# EAGLE design open-lux-E (EAGLE 6.5.0)
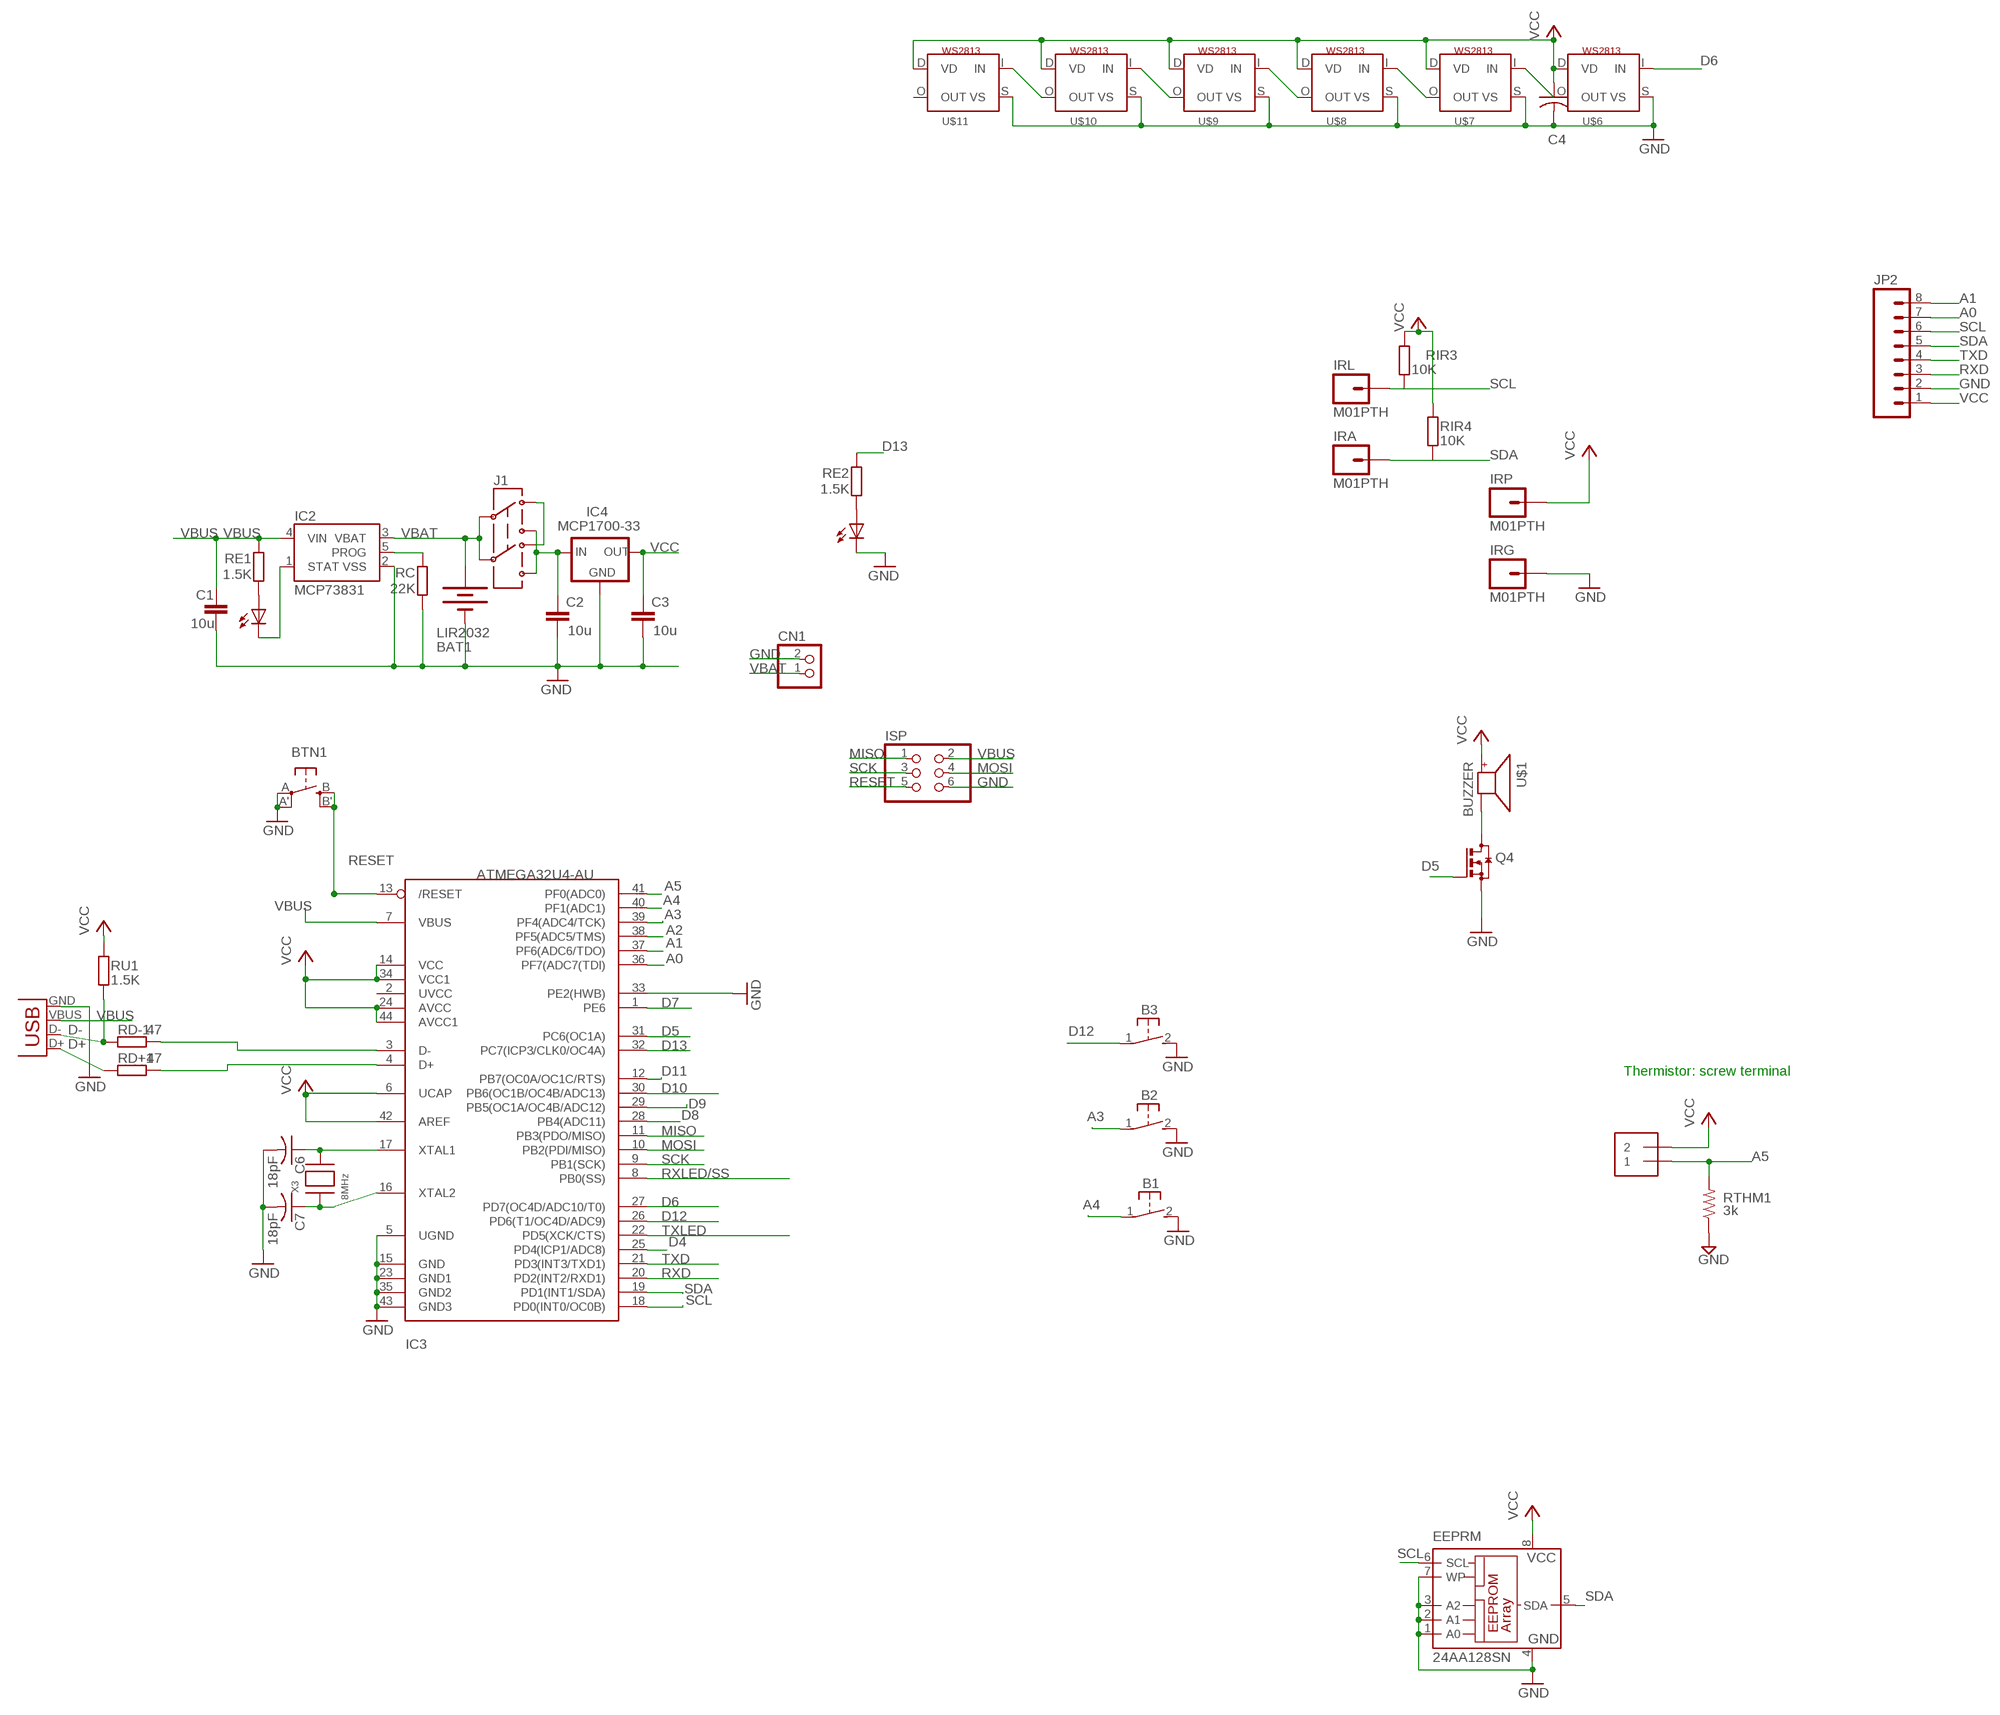
[diagram p0: schematic, sheet 1, part 1 of 2]
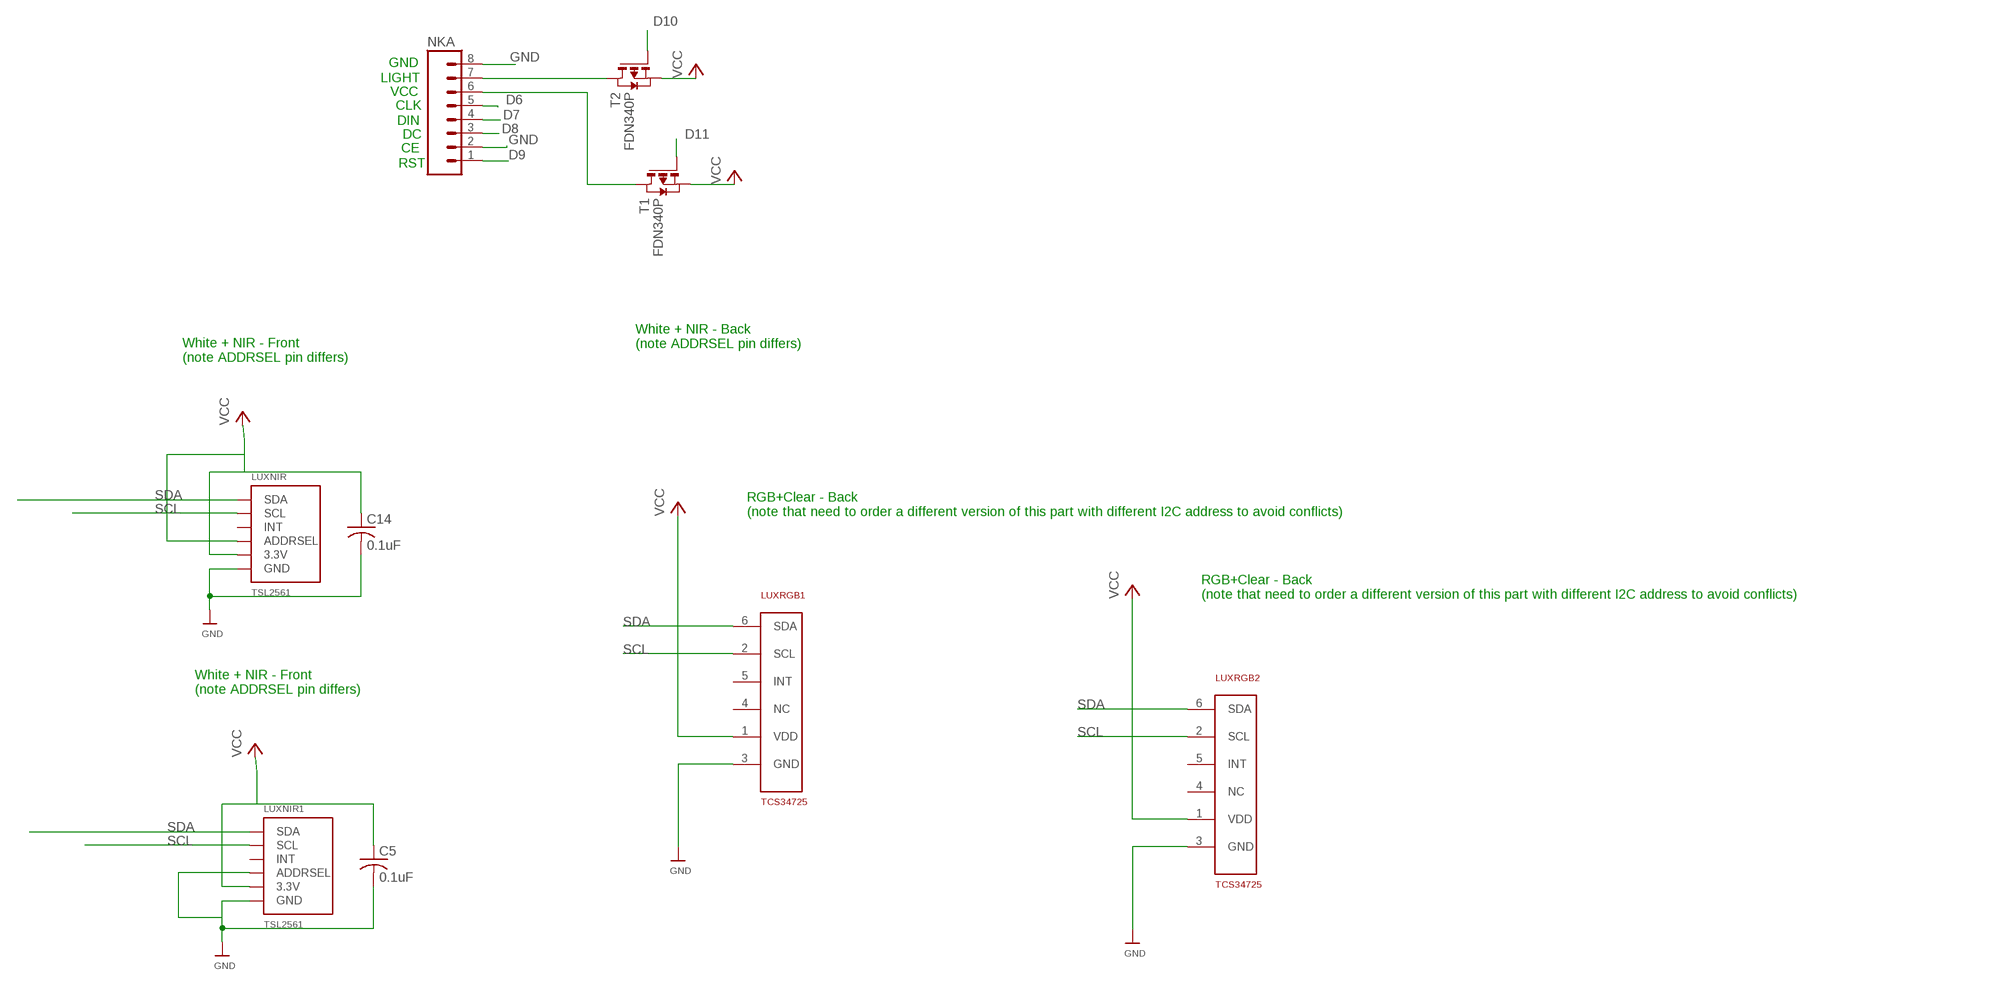
[diagram p1: schematic, sheet 1, part 2 of 2]

## Parts
B1  31-XX  [B3F-31XX]
B2  31-XX  [B3F-31XX]
B3  31-XX  [B3F-31XX]
BAT1  LIR2032  BATTERYBATTCOM_20MM_PTH_SMT  [BATTCOM_20MM_PTH_SMT]
BLNK  0805  LEDCHIPLED_0805  [CHIPLED_0805]
BTN1  EVQQ2  [EVQ-Q2]
C1  10u  C-EUC0805  [C0805]
C2  10u  C-EUC0805  [C0805]
C3  10u  C-EUC0805  [C0805]
C4  C-USC0805K  [C0805K]
C5  0.1uF  C-USC0805  [C0805]
C6  18pF  C-USC0805K  [C0805K]
C7  18pF  C-USC0805K  [C0805K]
C14  0.1uF  C-USC0805  [C0805]
CHARGE  0805  LEDCHIPLED_0805  [CHIPLED_0805]
CN1  JST_2PIN-SMT-RA  [JST-PH-2-SMT-RA]
EEPRM  24AA128SN  [SO-08]
IC2  MCP73831  [SOT23-5]
IC3  ATMEGA32U4-AU  [TQFP44]
IC4  MCP1700-33  MCP1700SOT233  [SOT23]
IRA  M01PTH  [1X01]
IRG  M01PTH  [1X01]
IRL  M01PTH  [1X01]
IRP  M01PTH  [1X01]
ISP  PINHD-2X3  [2X03]
J1  AYZ0202  [AYZ0202]
JP2  M08LOCK  [1X08_LOCK]
LUXNIR  TSL2561  [TSL2561_FN@1]
LUXNIR1  TSL2561  [TSL2561_FN@1]
LUXRGB1  TCS34725  [DFN-6]
LUXRGB2  TCS34725  [DFN-6]
NKA  M08LOCK  [1X08_LOCK]
Q4  BSS123  [SOT23]
RC  22K  R-EU_R0805  [R0805]
RD+1  47  R-EU_R0805  [R0805]
RD-1  47  R-EU_R0805  [R0805]
RE1  1.5K  R-EU_R0805  [R0805]
RE2  1.5K  R-EU_R0805  [R0805]
RIR3  10K  R-EU_R0805  [R0805]
RIR4  10K  R-EU_R0805  [R0805]
RTHM1  3k  R-US_R0805  [R0805@1]
RU1  1.5K  R-EU_R0805  [R0805]
T1  FDN340P  PMOSSOT23  [SOT-23]
T2  FDN340P  PMOSSOT23  [SOT-23]
THM1  1X2-3.5MM  [1X2-3.5MM]
U$1  BUZZER  [SMT-8585-BUZZER]
U$6  WS2813  [RGBLED5050_4]
U$7  WS2813  [RGBLED5050_4]
U$8  WS2813  [RGBLED5050_4]
U$9  WS2813  [RGBLED5050_4]
U$10  WS2813  [RGBLED5050_4]
U$11  WS2813  [RGBLED5050_4]
X2  USBSMD  [USB-MINIB]
X3  8MHz  XTALNX5032  [NX5032]

## Nets
A0: IC3.36(PF7(ADC7(TDI)) JP2.7
A1: IC3.37(PF6(ADC6/TDO)) JP2.8
A2: IC3.38(PF5(ADC5/TMS))
A3: B2.1(P) IC3.39(PF4(ADC4/TCK))
A4: B1.1(P) IC3.40(PF1(ADC1))
A5: IC3.41(PF0(ADC0)) RTHM1.2 THM1.1
D4: IC3.25(PD4(ICP1/ADC8))
D5: IC3.31(PC6(OC1A)) Q4.1(G)
D6: IC3.27(PD7(OC4D/ADC10/T0)) NKA.5 U$6.I(IN)
D7: IC3.1(PE6) NKA.4
D8: IC3.28(PB4(ADC11)) NKA.3
D9: IC3.29(PB5(OC1A/OC4B/ADC12)) NKA.1
D10: IC3.30(PB6(OC1B/OC4B/ADC13)) T2.3(G)
D11: IC3.12(PB7(OC0A/OC1C/RTS)) T1.3(G)
D12: B3.1(P) IC3.26(PD6(T1/OC4D/ADC9))
D13: IC3.32(PC7(ICP3/CLK0/OC4A)) RE2.2
D+: RD+1.1 X2.D+
D-: RD-1.1 RU1.1 X2.D-
GND: B1.2(S) B2.2(S) B3.2(S) BAT1.P$1(-) BLNK.C BTN1.A'(P1) BTN1.A(P) C1.2 C2.2 C3.2 C4.2 C5.2 C6.2 C7.2 C14.2 CN1.2 EEPRM.1(A0) EEPRM.2(A1) EEPRM.3(A2) EEPRM.4(GND) EEPRM.7(WP) IC2.2(VSS) IC3.5(UGND) IC3.15(GND) IC3.23(GND1) IC3.33(PE2(HWB)) IC3.35(GND2) IC3.43(GND3) IC4.1(GND) IRG.1 ISP.6 JP2.2 LUXNIR1.ADR(ADDRSEL) LUXNIR1.VSS(GND) LUXNIR.VSS(GND) LUXRGB1.3(GND) LUXRGB2.3(GND) NKA.2 NKA.8 Q4.2(S) RC.1 RTHM1.1 U$6.S(VS) U$7.S(VS) U$8.S(VS) U$9.S(VS) U$10.S(VS) U$11.S(VS) X2.GND
MISO: IC3.11(PB3(PDO/MISO)) ISP.1
MOSI: IC3.10(PB2(PDI/MISO)) ISP.4
N$1: J1.3 J1.6
N$2: C7.1 IC3.16(XTAL2) X3.P$1
N$3: C6.1 IC3.17(XTAL1) X3.P$2
N$4: NKA.7 T2.1(D)
N$5: CHARGE.C IC2.1(STAT)
N$6: IC2.5(PROG) RC.2
N$7: Q4.3(D) U$1.-
N$8: NKA.6 T1.1(D)
N$10: CHARGE.A RE1.1
N$18: BLNK.A RE2.1
N$21: IC3.4(D+) RD+1.2
N$22: IC3.3(D-) RD-1.2
N$23: U$6.O(OUT) U$7.I(IN)
N$24: U$7.O(OUT) U$8.I(IN)
N$25: U$8.O(OUT) U$9.I(IN)
N$26: U$9.O(OUT) U$10.I(IN)
N$28: U$10.O(OUT) U$11.I(IN)
RESET: BTN1.B'(S1) BTN1.B(S) IC3.13(/RESET) ISP.5
RXD: IC3.20(PD2(INT2/RXD1)) JP2.3
RXLED/SS: IC3.8(PB0(SS))
SCK: IC3.9(PB1(SCK)) ISP.3
SCL: EEPRM.6(SCL) IC3.18(PD0(INT0/OC0B)) IRL.1 JP2.6 LUXNIR1.CLK(SCL) LUXNIR.CLK(SCL) LUXRGB1.2(SCL) LUXRGB2.2(SCL) RIR3.1
SDA: EEPRM.5(SDA) IC3.19(PD1(INT1/SDA)) IRA.1 JP2.5 LUXNIR1.DATA(SDA) LUXNIR.DATA(SDA) LUXRGB1.6(SDA) LUXRGB2.6(SDA) RIR4.1
TXD: IC3.21(PD3(INT3/TXD1)) JP2.4
TXLED: IC3.22(PD5(XCK/CTS))
VBAT: BAT1.P$2(+) CN1.1 IC2.3(VBAT) J1.2 J1.5
VBUS: C1.1 IC2.4(VIN) IC3.7(VBUS) ISP.2 RE1.2 X2.VBUS
VCC: C3.1 C4.1 C5.1 C14.1 EEPRM.8(VCC) IC3.6(UCAP) IC3.14(VCC) IC3.24(AVCC) IC3.34(VCC1) IC3.42(AREF) IC3.44(AVCC1) IC4.2(OUT) IRP.1 JP2.1 LUXNIR1.VDD(3.3V) LUXNIR.ADR(ADDRSEL) LUXNIR.VDD(3.3V) LUXRGB1.1(VDD) LUXRGB2.1(VDD) RIR3.2 RIR4.2 RU1.2 T1.2(S) T2.2(S) THM1.2 U$1.+ U$6.D(VD) U$7.D(VD) U$8.D(VD) U$9.D(VD) U$10.D(VD) U$11.D(VD)
VDD: C2.1 IC4.3(IN) J1.1 J1.4
Unconnected: IC3.2(UVCC) LUXNIR1.INT LUXNIR.INT LUXRGB1.4(NC) LUXRGB1.5(INT) LUXRGB2.4(NC) LUXRGB2.5(INT) U$11.O(OUT)

## Notes on the sheet
- GND
- LIGHT
- VCC
- CLK
- DIN
- DC
- CE
- RST
- White + NIR - Back
  (note ADDRSEL pin differs)
- White + NIR - Front
  (note ADDRSEL pin differs)
- RGB+Clear - Back 
  (note that need to order a different version of this part with different I2C address to avoid conflicts)
- RGB+Clear - Back 
  (note that need to order a different version of this part with different I2C address to avoid conflicts)
- White + NIR - Front
  (note ADDRSEL pin differs)
- Thermistor: screw terminal

## Library data of the parts
B1-B3 = adafruit:31-XX: OMRON SWITCH Now with beefier pads!
BAT1 = SparkFunNew:BATTERY: Battery Holders Various common sizes : AA, AAA, 20mm coin cell and 12mm coin cell.
BLNK CHARGE = led:LED: LED OSRAM: - CHIPLED LG R971, LG N971, LY N971, LG Q971, LY Q971, LO R971, LY R971 LH N974, LH R974 LS Q976, LO Q976, LY Q976 LO Q996 - Hyper CHIPLED LW Q18S LB Q993, LB Q99A, LB R99A - SideLED LS A670, LO A670, LY A670, LG A670, LP A670 LB A673, LV A673, LT A673, LW A673 LH A674 LY A675 LS A676, LA A676, LO A676, LY A676, LW A676 LS A679, LY A679, LG A679 - Hyper Micro SIDELED® LS Y876, LA Y876, LO Y876, LY Y876 LT Y87S - SmartLED LW L88C, LW L88S LB L89C, LB L89S, LG L890 LS L89K, LO L89K, LY L89K LS L896, LA L896, LO L896, LY L896 - TOPLED LS T670, LO T670, LY T670, LG T670, LP T670 LSG T670, LSP T670, LSY T670, LOP T670, LYG T670 LG T671, LOG T671, LSG T671 LB T673, LV T673, LT T673, LW T673 LH T674 LS T676, LA T676, LO T676, LY T676, LB T676, LH T676, LSB T676, LW T676 LB T67C, LV T67C, LT T67C, LS T67K, LO T67K, LY T67K, LW E67C LS E67B, LA E67B, LO E67B, LY E67B, LB E67C, LV E67C, LT E67C LW T67C LS T679, LY T679, LG T679 LS T770, LO T770, LY T770, LG T770, LP T770 LB T773, LV T773, LT T773, LW T773 LH T774 LS E675, LA E675, LY E675, LS T675 LS T776, LA T776, LO T776, LY T776, LB T776 LHGB T686 LT T68C, LB T68C - Hyper Mini TOPLED® LB M676 - Mini TOPLED Santana® LG M470 LS M47K, LO M47K, LY M47K Source: http://www.osram.convergy.de LUXEON: - LUMILED® LXK2-PW12-R00, LXK2-PW12-S00, LXK2-PW14-U00, LXK2-PW14-V00 LXK2-PM12-R00, LXK2-PM12-S00, LXK2-PM14-U00 LXK2-PE12-Q00, LXK2-PE12-R00, LXK2-PE12-S00, LXK2-PE14-T00, LXK2-PE14-U00 LXK2-PB12-K00, LXK2-PB12-L00, LXK2-PB12-M00, LXK2-PB14-N00, LXK2-PB14-P00, LXK2-PB14-Q00 LXK2-PR12-L00, LXK2-PR12-M00, LXK2-PR14-Q00, LXK2-PR14-R00 LXK2-PD12-Q00, LXK2-PD12-R00, LXK2-PD12-S00 LXK2-PH12-R00, LXK2-PH12-S00 LXK2-PL12-P00, LXK2-PL12-Q00, LXK2-PL12-R00 Source: www.luxeon.com KINGBRIGHT: KA-3528ASYC Source: www.kingbright.com
BTN1 = adafruit:EVQQ2: SMT 6mm switch, EVQQ2 series http://www.ladyada.net/library/eagle
C1-C3 = resistor:C-EU: CAPACITOR, European symbol
C4 = adafruit2013:C-US: CAPACITOR, American symbol
C5-C7 C14 = adafruit:C-US: CAPACITOR, American symbol
CN1 = adafruit:JST_2PIN: JST 2-Pin Connectors of various flavors SMT-RA (S2B-PH-SM4) 4UConnector #17311 SMT (B2B-PH-SM4) THM-RA (S2B-PH) THM (B2B-PH)
EEPRM = microchip:24*: Serial EEPROM I2C; MF: MICROCHIP; MPN: 24AA128-I/SN; OC_FARNELL: unknown; OC_NEWARK: 92C6842
IC2 = SparkFunNew:MCP73831: Microchip's MCP73831 Miniature single cell, fully integrated Li-Ion, Li-polymer charge management controller http://ww1.microchip.com/downloads/en/DeviceDoc/21984a.pdf
IC3 = adaprog:ATMEGA32U4
IC4 = adafruit:MCP1700: VOLTAGE REGULATOR
IRA IRG IRL IRP = SparkFun-Connectors:M01: Header 1 Standard 1-pin 0.1" header. Use with straight break away headers (SKU : PRT-00116), right angle break away headers (PRT-00553), swiss pins (PRT-00743), machine pins (PRT-00117), and female headers (PRT-00115).
ISP = pinhead:PINHD-2X3: PIN HEADER
J1 = SparkFunNew:AYZ0202: SPDT Slide Switch Simple SMD single-pull double-throw slide switch. Good for less than 350mA power switch, switching UARTs between devices, etc. Spark Fun Electronics SKU : COM-00597
JP2 NKA = SparkFun-Connectors:M08: Header 8 Standard 8-pin 0.1" header. Use with straight break away headers (SKU : PRT-00116), right angle break away headers (PRT-00553), swiss pins (PRT-00743), machine pins (PRT-00117), and female headers (PRT-00115).
LUXNIR LUXNIR1 = microbuilder:TSL2561: TSL2561 Light-To-Digital Sensor Mouser Part Numbers: CS (obsolete): 856-TSL2561CS DFN (cheapest): 856-TSL2561FN
LUXRGB1 LUXRGB2 = dwbLibrary:TCS34725
Q4 = transistor-small-signal:BSS123: N-CHANNEL MOS FET
RC RD+1 RD-1 RE1 RE2 RIR3 RIR4 RU1 = rcl:R-EU_: RESISTOR, European symbol
RTHM1 = rcl:R-US_: RESISTOR, American symbol
T1 T2 = zetex:PMOSSOT23: MOS FET
THM1 = adafruit:1X2: 3.5mm Terminal block http://www.ladyada.net/library/pcb/eaglelibrary.html
U$1 = adafruit:BUZZER
U$6-U$11 = adafruit:WS2813
X2 = SparkFun:USB: USB Connectors USB-B-PTH is fully proven SKU : PRT-00139 USB-miniB is fully proven SKU : PRT-00587 USB-A-PCB is untested. USB-A-H is throughly reviewed, but untested. Spark Fun Electronics SKU : PRT-00437 USB-B-SMT is throughly reviewed, but untested. Needs silkscreen touching up. USB-A-S has not been used/tested USB-MB-H has not been used/tested
X3 = adaprog:XTAL

## Net classes
0 default: width 0.254 mm, clearance 0.203 mm
1 power: width 0.254 mm, clearance 0.203 mm

## Board
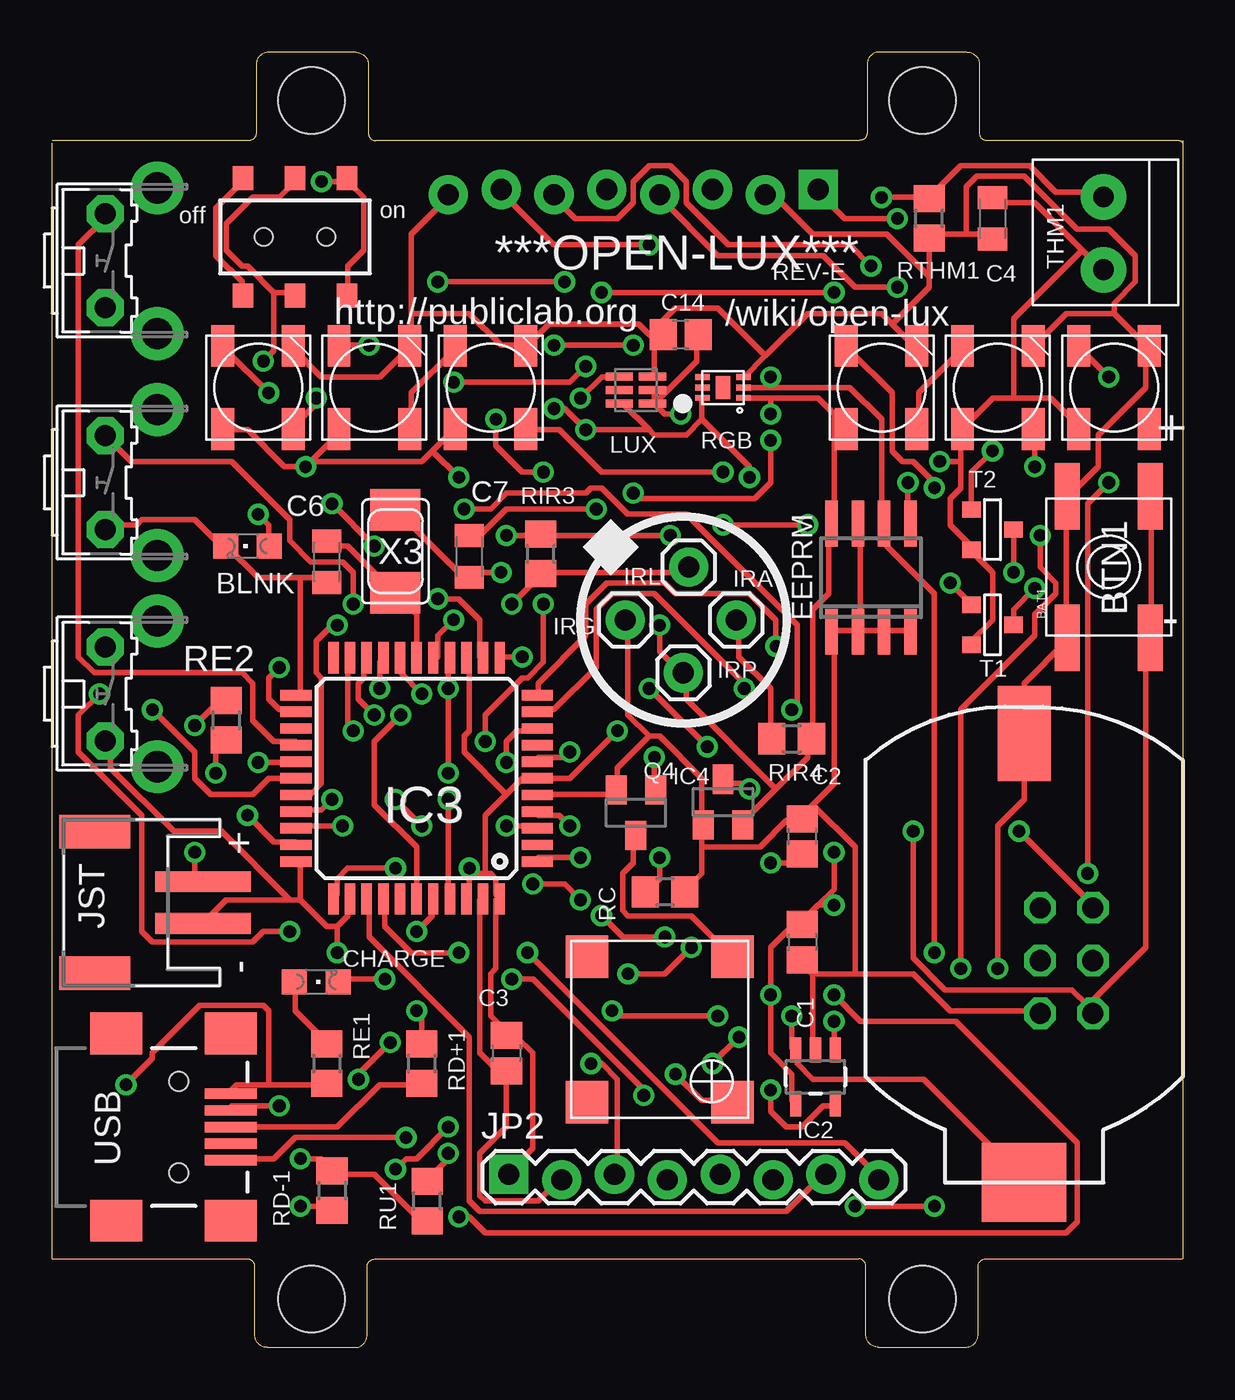
[diagram p2: board, top side]
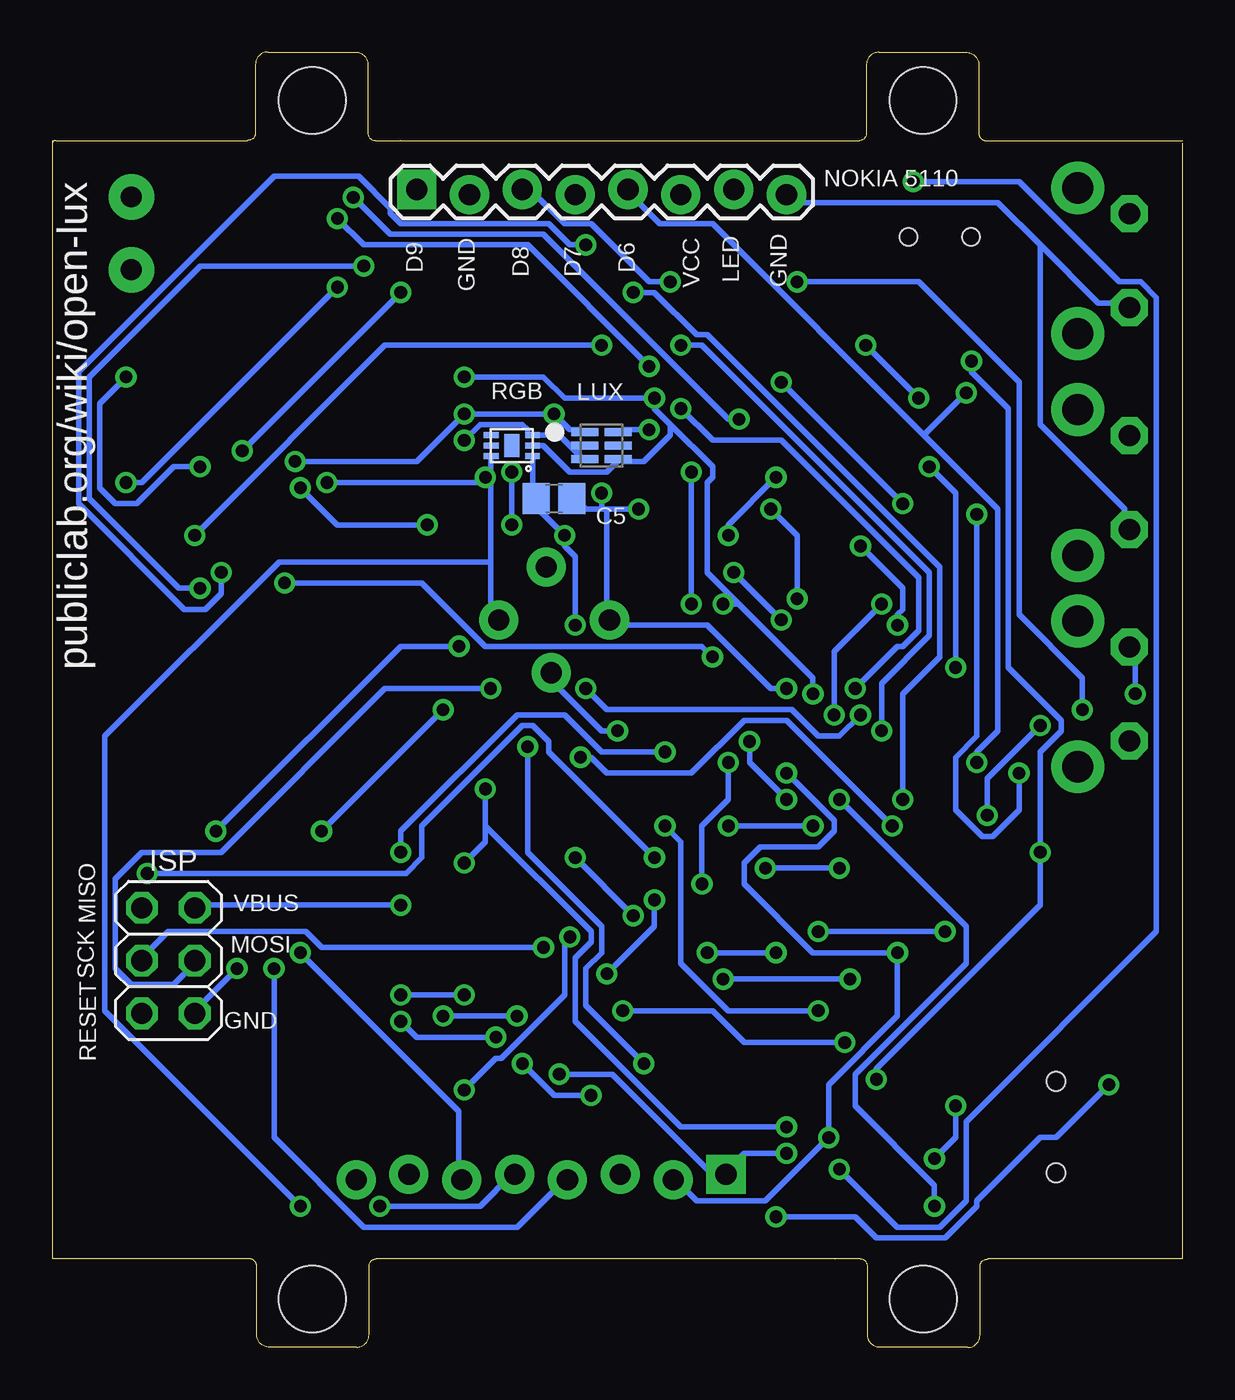
[diagram p3: board, bottom side, seen from below]

Size 54.36 x 62.3 mm. Coordinates in mm from the lower left corner, seen from the top.
Outline: 54.36,57.85 54.36,4.25
Outline: 0,4.25 0,4.27
Outline: 0,4.27 0,57.91
Outline: 38.77,4.26 arc-90 39.12,3.92 39.12,0.61 arc90 39.72,0.01 43.92,0.01 arc90 44.52,0.61 44.52,3.92 arc-90 44.87,4.26 54.33,4.26
Outline: 15.5,4.25 arc90 15.15,3.9 15.15,0.6 arc-90 14.55,0 10.35,0 arc-90 9.75,0.6 9.75,3.9 arc90 9.4,4.25
Outline: 9.39,4.25 arc90 9.37,4.26 0.01,4.26 arc-90 0,4.27
Outline: 15.51,4.26 16.72,4.26
Outline: 16.72,4.26 arc-90 16.73,4.25 16.73,4.25
Outline: 16.72,4.26 38.79,4.26
Outline: 54.36,58.04 54.36,57.87 arc90 54.19,58.04 44.96,58.04 arc-90 44.94,58.05
Outline: 15.56,58.04 arc-90 15.21,58.39 15.21,61.69 arc90 14.61,62.29 10.41,62.29 arc90 9.81,61.69 9.81,58.39 arc-90 9.46,58.04 0,58.04
Outline: 38.83,58.05 arc90 39.18,58.4 39.18,61.7 arc-90 39.78,62.3 43.98,62.3 arc-90 44.58,61.7 44.58,58.4 arc90 44.93,58.05
Outline: 38.82,58.04 37.61,58.04
Outline: 37.61,58.04 arc-90 37.6,58.05 37.6,58.05
Outline: 37.61,58.04 15.54,58.04
Copper layers (1*16): Top 0.035mm / dielectric 1.5mm / Bottom 0.035mm
Design rules "default": minimum track width 10mil, minimum drill 24mil, track to track 8mil, track to pad 8mil, pad to pad 8mil, via to via 8mil, smd to smd 8mil, copper to edge 40mil, drill to drill 8mil, minimum pad ring 10mil, minimum via ring 8mil, stop-mask expansion 4mil, vias tented up to drill 0mil, thermal gap 10mil
Holes 3.2 mm at 41.85,2.34 12.48,2.32 12.48,59.96 41.85,59.98

### Footprints (pad centres in the part's own frame; a part is rotated, then mirrored left to right if it is on the bottom)
B3F-31XX = drill 1.016 pad 1.778 octagon: 1 -2.261,-1.245; 2 2.261,-1.245 | drill 1.499 pad 2.54: 3 -3.505,1.245; 4 3.505,1.245
BATTCOM_20MM_PTH_SMT = smd 4.572 x 2.54: P$1 0,0 | smd 3.81 x 4.064: P$2 21.59,0
CHIPLED_0805 = smd 1.2 x 1.2: A 0,-1.05; C 0,1.05
EVQ-Q2 = smd 3.2 x 1.2: A -3.4,-2; A' 3.4,-2; B -3.4,2; B' 3.4,2
C0805 = smd 1.3 x 1.5: 1 -0.85,0; 2 0.85,0
C0805K = smd 1.1 x 1.4: 1 -1,0; 2 1,0
JST-PH-2-SMT-RA = smd 1 x 4.6: 1 1,-3.7; 2 -1,-3.7 | smd 1.6 x 3.4: NC1 -3.4,1.5; NC2 3.4,1.5
SO-08 = smd 0.6 x 2.2: 1 -1.905,-2.6; 2 -0.635,-2.6; 3 0.635,-2.6; 4 1.905,-2.6; 5 1.905,2.6; 6 0.635,2.6; 7 -0.635,2.6; 8 -1.905,2.6
SOT23-5 = smd 0.55 x 1.2: 1 -0.95,-1.3; 2 0,-1.3; 3 0.95,-1.3; 4 0.95,1.3; 5 -0.95,1.3
TQFP44 = smd 1.5 x 0.5: 1 -5.8,4; 2 -5.8,3.2; 3 -5.8,2.4; 4 -5.8,1.6; 5 -5.8,0.8; 6 -5.8,0; 7 -5.8,-0.8; 8 -5.8,-1.6; 9 -5.8,-2.4; 10 -5.8,-3.2; 11 -5.8,-4; 23 5.8,-4; 24 5.8,-3.2; 25 5.8,-2.4; 26 5.8,-1.6; 27 5.8,-0.8; 28 5.8,0; 29 5.8,0.8; 30 5.8,1.6; 31 5.8,2.4; 32 5.8,3.2; 33 5.8,4 | smd 0.5 x 1.5: 12 -4,-5.8; 13 -3.2,-5.8; 14 -2.4,-5.8; 15 -1.6,-5.8; 16 -0.8,-5.8; 17 0,-5.8; 18 0.8,-5.8; 19 1.6,-5.8; 20 2.4,-5.8; 21 3.2,-5.8; 22 4,-5.8; 34 4,5.8; 35 3.2,5.8; 36 2.4,5.8; 37 1.6,5.8; 38 0.8,5.8; 39 0,5.8; 40 -0.8,5.8; 41 -1.6,5.8; 42 -2.4,5.8; 43 -3.2,5.8; 44 -4,5.8
SOT23 = smd 1 x 1.4: 1 -0.95,-1.1; 2 0.95,-1.1; 3 0,1.1
1X01 = drill 1.016 pad 1.88: 1 0,0
2X03 = drill 1.016 octagon: 1 -2.54,-1.27; 2 -2.54,1.27; 3 0,-1.27; 4 0,1.27; 5 2.54,-1.27; 6 2.54,1.27
AYZ0202 = smd 1 x 1.15: 1 -2.5,2.825; 2 0,2.825; 3 2.5,2.825; 4 -2.5,-2.825; 5 0,-2.825; 6 2.5,-2.825 | hole 0.85: 1.5,0; -1.5,0
1X08_LOCK = drill 1.016 pad 1.88 square: 1 0,0.127 | drill 1.016 pad 1.88: 2 2.54,-0.127; 3 5.08,0.127; 4 7.62,-0.127; 5 10.16,0.127; 6 12.7,-0.127; 7 15.24,0.127; 8 17.78,-0.127
TSL2561_FN@1 = smd 1.3 x 0.4: ADR -0.8,0; CLK 0.8,-0.65; DATA 0.8,0.65; INT 0.8,0; VDD -0.8,0.65; VSS -0.8,-0.65
DFN-6 = smd 0.28 x 0.7: 1 -0.5,-0.988; 2 0,-0.988; 3 0.5,-0.988; 4 0.5,0.988; 5 0,0.988; 6 -0.5,0.988 | smd 1.1 x 0.7: P$1 0,0
R0805 = smd 1.3 x 1.5: 1 -0.95,0; 2 0.95,0
R0805@1 = smd 1.3 x 1.5: 1 -0.95,0; 2 0.95,0
SOT-23 = smd 0.787 x 0.889: 1 0.025,-1.016; 2 -0.94,1.016; 3 0.991,1.016
1X2-3.5MM = drill 1 pad 2.184: 1 1.8,0; 2 -1.7,0
SMT-8585-BUZZER = smd 2.05 x 2.05: + -3.5,-3.5; - 3.5,-3.5; NC1 -3.5,3.5; NC2 3.5,3.5
RGBLED5050_4 = smd 2 x 1.1: D -2,1.7; I 2,1.7; O -2,-1.7; S 2,-1.7
USB-MINIB = smd 2.5 x 0.5: D+ 2.5,0; D- 2.5,0.8; GND 2.5,-1.6; ID 2.5,-0.8; VBUS 2.5,1.6 | smd 2.5 x 2: GND@1 -3,-4.5; GND@2 -3,4.5; GND@3 2.5,4.5; GND@4 2.5,-4.5 | hole 0.9: 0,2.2; 0,-2.2
NX5032 = smd 2 x 2.4: P$1 2,0; P$2 -2,0

### Placement (x,y rotation side)
B1  3.81,31.43 270 top
B2  3.81,41.59 270 top
B3  3.81,52.26 270 top
BAT1  46.74,29.53 270 top
BLNK  9.4,38.55 90 top
BTN1  50.8,37.53 270 top
C1  36.07,19.5 270 top
C2  36.07,24.57 90 top
C3  21.84,14.16 270 top
C4  45.21,54.29 270 top
C5  30.23,40.83 0 bottom
C6  13.21,37.78 270 top
C7  20.07,38.04 90 top
C14  30.23,48.71 180 top
CHARGE  12.7,17.59 270 top
CN1  3.56,21.4 90 top
EEPRM  39.37,37.02 0 top
IC2  36.7,13.02 180 top
IC3  17.53,27.37 180 top
IC4  32.26,26.23 0 top
IRA  32.89,34.99 0 top
IRG  27.56,34.99 0 top
IRL  30.61,37.53 0 top
IRP  30.35,32.45 0 top
ISP  48.77,18.61 270 bottom
J1  11.68,53.4 180 top
JP2  21.96,8.19 0 top
LUXNIR  28.07,46.04 180 top
LUXNIR1  27.94,43.37 0 bottom
LUXRGB1  32.26,46.16 90 top
LUXRGB2  32.26,43.37 90 bottom
NKA  36.83,55.56 0 bottom
Q4  28.07,25.72 180 top
RC  29.46,21.91 180 top
RD+1  17.78,13.65 90 top
RD-1  13.46,7.56 270 top
RE1  13.21,13.65 270 top
RE2  8.38,30.16 90 top
RIR3  23.5,38.16 90 top
RIR4  35.56,29.27 0 top
RTHM1  42.16,54.29 90 top
RU1  18.03,7.05 90 top
T1  45.21,34.73 90 top
T2  45.21,39.31 90 top
THM1  50.55,53.53 90 top
U$1  29.21,15.3 90 top
U$6  9.91,46.16 90 top
U$7  15.49,46.16 90 top
U$8  21.08,46.16 90 top
U$9  39.88,46.16 90 top
U$10  45.47,46.16 90 top
U$11  51.05,46.16 90 top
X2  6.1,10.61 0 top
X3  16.51,38.29 90 top

### Tracks (layer width: path | path; a pad name or v marks a point on that pad's centre or on a via)
A0
  Top 0.254: IC3.36 15.24,21.53 15.24,19.75 20.07,14.92 20.07,7.05 20.57,6.54 35.31,6.54 37.08,8.32 JP2.7
A1  (via drill 0.61)
  Top 0.254: v19.56,18.99 17.27,18.99 16,20.26 16,21.53 IC3.37 | v22.86,18.99 32,9.84 38.1,9.84 39.62,8.32 JP2.8
  Bottom 0.254: v22.86,18.99 v19.56,18.99
A3  (via drill 0.61)
  Top 0.254: IC3.39 17.53,24.07 15.49,26.1 15.49,29.15 v16.76,30.42 | v14.48,35.75 14.48,37.28 13.97,37.78 12.45,37.78 11.43,38.8 11.43,39.82 8.64,42.61 3.81,42.61 B2.1
  Bottom 0.254: v16.76,30.42 16.76,33.47 v14.48,35.75
A4  (via drill 0.61)
  Top 0.254: v17.53,20 18.29,20.77 18.29,21.53 IC3.40 | v11.43,20 10.16,20 9.65,19.5 4.83,19.5 4.32,20 4.32,25.59 1.27,28.64 1.27,30.42 v2.29,31.43
  Bottom 0.254: v11.43,20 v17.53,20 | v2.29,31.43 2.29,33.21 2.54,33.47 B1.1
A5  (via drill 0.61)
  Top 0.254: v19.05,26.35 19.05,21.78 IC3.41 | v20.83,29.15 20.83,30.42 22.61,32.2 22.86,32.2 23.62,32.96 v23.62,35.75 | v23.62,42.1 22.61,42.1 21.34,43.37 v21.34,44.64 | 42.16,55.31 v39.88,55.31 | 42.16,55.31 43.69,56.83 46.99,56.83 48.26,55.56 50.55,55.56 THM1.1 | 42.16,55.31 RTHM1.2
  Bottom 0.254: v19.05,26.35 20.83,28.13 v20.83,29.15 | v23.62,42.1 v23.62,35.75 | v21.34,44.64 21.84,44.64 30.73,53.53 38.1,53.53 v39.88,55.31
D5  (via drill 0.61)
  Top 0.254: v28.96,28.38 28.96,26.86 Q4.1 | v13.97,25.08 11.94,25.08 IC3.31
  Bottom 0.254: v28.96,28.38 28.45,28.38 27.69,27.62 23.62,27.62 21.08,30.16 19.05,30.16 v13.97,25.08
D6  (via drill 0.61)
  Top 0.254: v9.91,28.13 11.68,28.13 IC3.27 | v10.41,45.91 8.38,47.94 U$6.I
  Bottom 0.254: v9.91,28.13 9.91,28.64 8.89,29.65 8.89,40.32 12.45,43.88 | 12.45,43.88 22.61,54.04 25.15,54.04 26.67,55.56 NKA.5 | 12.45,43.88 v10.41,45.91
D7  (via drill 0.61)
  Top 0.254: v25.4,23.56 23.37,23.56 IC3.1 | v49.78,22.8 49.78,40.58 v50.8,41.59 | v40.64,50.99 38.61,50.99 37.08,52.52 32,52.52 29.21,55.31 NKA.4
  Bottom 0.254: v25.4,23.56 30.48,28.64 30.48,29.15 31.24,29.91 31.75,29.91 36.58,25.08 36.58,23.56 37.34,22.8 v49.78,22.8 | v50.8,41.59 50.04,41.59 v40.64,50.99
D8  (via drill 0.61)
  Top 0.254: IC3.28 10.41,27.37 9.65,26.61 7.62,26.61 6.86,27.37 6.86,28.64 v4.83,30.67 | v24.64,51.25 v18.54,51.25
  Bottom 0.254: v4.83,30.67 4.83,32.2 7.87,35.24 7.87,46.42 12.7,51.25 v18.54,51.25 | v24.64,51.25 25.65,51.25 28.45,54.04 29.72,54.04 31.24,55.56 31.75,55.56 NKA.3
D9  (via drill 0.61)
  Top 0.254: v13.72,34.73 13.46,34.73 12.7,33.97 12.7,32.45 12.95,32.2 12.95,27.11 12.45,26.61 11.94,26.61 IC3.29 | v13.46,40.58 v15.49,38.55 | v19.3,46.42 24.89,46.42 v25.65,47.18 | v40.64,54.29 38.1,54.29 36.83,55.56 NKA.1
  Bottom 0.254: v13.72,34.73 13.72,35.24 13.46,35.5 13.46,36.51 v15.49,38.55 | v19.3,46.42 v13.46,40.58 | v25.65,47.18 31.5,53.02 39.37,53.02 v40.64,54.29
D10  (via drill 0.61)
  Top 0.254: T2.3 44.2,42.1 v45.21,43.12 | v26.42,50.74 v37.59,50.74 | v13.46,26.35 12.95,25.84 11.94,25.84 IC3.30
  Bottom 0.254: v37.59,50.74 v45.21,43.12 | v26.42,50.74 25.4,50.74 23.37,48.71 22.86,48.71 11.68,37.53 11.68,33.21 13.46,31.43 v13.46,26.35
D11  (via drill 0.61)
  Top 0.254: v43.18,36.77 44.2,35.75 T1.3 | v22.61,33.21 21.59,33.21 IC3.12
  Bottom 0.254: v43.18,36.77 36.58,36.77 33.53,33.72 23.11,33.72 v22.61,33.21
D12
  Top 0.254: IC3.26 11.68,29.15 10.67,29.15 9.65,30.16 9.65,31.94 9.14,32.45 2.03,32.45 1.27,33.21 1.27,53.02 2.54,54.29 B3.1
D13  (via drill 0.61)
  Top 0.254: v9.4,25.59 10.67,24.32 11.68,24.32 IC3.32 | v6.86,29.91 7.87,30.93 8.38,30.93 RE2.2
  Bottom 0.254: v9.4,25.59 9.4,27.37 v6.86,29.91
D+
  Top 0.254: X2.D+ 13.72,10.61 15.75,12.64 17.78,12.64 RD+1.1
D-  (via drill 0.61)
  Top 0.254: RU1.1 18.03,6.29 17.53,6.29 15.49,8.32 13.46,8.32 RD-1.1 13.46,8.57 12.95,9.08 v11.94,9.08 | v10.92,11.62 8.64,11.62 X2.D-
  Bottom 0.254: v10.92,11.62 10.92,10.1 v11.94,9.08
GND  (via drill 0.61)
  Top 0.254: 51.05,49.72 48.77,49.72 47.24,48.2 U$10.S | 51.05,49.72 52.58,48.2 U$11.S 52.58,47.94 52.58,46.16 50.29,43.88 50.29,42.36 49.02,41.09 BTN1.A 48.77,40.83 48.77,34.23 BTN1.A' 48.77,33.97 46.74,31.94 BAT1.P$1 46.74,26.35 45.47,25.08 v45.47,18.23 | 43.94,53.53 42.16,53.53 RTHM1.1 42.16,51.5 | 43.94,53.53 45.21,53.53 C4.2 | 34.29,47.69 36.32,49.72 39.88,49.72 40.39,49.21 | 34.29,47.69 33.27,46.67 LUXRGB1.3 | 40.39,49.21 41.4,48.2 U$9.S | 42.16,51.5 42.16,50.99 40.39,49.21 | 42.16,51.5 40.13,53.53 36.58,53.53 34.8,55.31 34.29,55.31 NKA.2 | 11.94,37.02 13.21,37.02 C6.2 | 11.94,37.02 9.91,37.02 8.38,38.55 BLNK.C 8.13,38.55 6.86,39.82 4.32,39.82 4.06,39.56 2.79,39.56 B2.2 | 11.94,37.02 11.94,31.43 IC3.23 | 28.96,48.45 28.96,46.67 LUXNIR.VSS | 28.96,48.45 29.21,48.71 C14.2 28.96,48.45 | 28.96,48.45 28.7,48.71 | 28.7,48.71 28.19,49.21 23.88,49.21 22.86,48.2 U$8.S 22.61,48.2 21.59,48.2 20.07,49.72 17.27,49.72 | U$6.S 11.68,47.94 12.95,46.67 15.75,46.67 17.02,47.94 U$7.S 17.27,48.2 17.27,49.72 | 17.27,49.72 17.27,53.53 19.05,55.31 NKA.8 | 34.29,47.69 32,49.98 29.97,49.98 28.7,48.71 | 51.05,49.72 51.05,50.23 52.07,51.25 52.07,52.52 50.8,53.79 49.28,53.79 46.74,56.33 44.45,56.33 43.94,55.82 43.94,53.53 | 13.72,20.26 14.22,20.77 14.22,21.53 IC3.35 | 13.72,20.26 13.21,20.26 11.94,21.53 | 11.94,21.53 11.94,23.3 IC3.33 | 11.43,21.53 8.38,21.53 7.37,20.51 CN1.2 | 11.43,21.53 11.94,21.53 | 11.43,21.53 8.13,24.83 5.84,24.83 2.79,27.88 2.79,29.15 B1.2 | IC3.43 20.57,21.53 20.57,14.16 21.34,13.4 21.84,13.4 C3.2 21.84,10.61 20.57,9.34 20.57,7.3 20.83,7.05 23.37,7.05 24.38,8.06 JP2.2
  Top 0.254: v17.02,10.1 11.68,10.1 10.67,9.08 8.64,9.08 X2.GND | v13.72,18.99 13.72,20.26 | IC3.15 19.05,32.96 v19.05,31.69 v19.05,27.62 | v26.16,40.32 21.84,40.32 20.57,39.05 20.07,39.05 C7.2 | v34.54,43.62 34.54,41.59 33.78,40.83 28.19,40.83 v27.94,41.09 | 36.58,17.97 36.58,14.41 IC2.2 | 36.58,17.97 36.07,18.48 C1.2 | 38.61,17.97 41.4,17.97 43.18,16.19 47.5,16.19 ISP.6 | 38.61,17.97 36.58,17.97 | 41.4,34.48 EEPRM.4 41.15,34.48 40.13,34.48 EEPRM.3 39.88,34.48 38.86,34.48 | 38.86,34.48 38.86,39.56 EEPRM.7 | 38.86,34.48 EEPRM.2 38.61,34.48 37.59,34.48 EEPRM.1 37.59,34.23 37.59,27.11 36.58,26.1 | IC3.5 23.37,26.61 26.92,26.61 Q4.2 27.18,26.86 27.18,27.88 28.7,29.4 | 31.24,24.07 31.24,22.8 30.48,22.04 RC.1 | 31.24,24.07 31.24,25.08 IC4.1 31.24,25.34 31.24,27.37 29.21,29.4 28.7,29.4 | 31.24,24.07 34.04,24.07 35.31,25.34 36.07,25.34 C2.2 36.07,25.59 36.58,26.1 | 38.61,17.97 38.61,24.07 36.58,26.1 | 28.7,29.4 27.69,30.42 27.69,34.99 IRG.1
  Bottom 0.254: 6.86,53.02 8.89,55.05 18.8,55.05 19.05,55.31 NKA.8 | 6.86,53.02 4.06,50.23 2.79,50.23 B3.2 | 6.86,53.02 6.86,44.39 2.79,40.32 2.79,39.56 B2.2 | JP2.2 24.38,8.06 23.37,7.05 20.07,7.05 v17.02,10.1 17.02,12.64 13.72,15.94 v13.72,18.99 17.78,18.99 21.08,22.29 21.08,23.3 20.32,24.07 17.53,24.07 16.76,24.83 16.76,25.34 v19.05,27.62 | v19.05,31.69 19.81,31.69 22.86,34.73 27.18,34.73 27.43,34.99 IRG.1 27.69,34.99 27.69,40.32 | 29.21,43.12 28.96,42.86 LUXNIR1.VSS | 29.21,43.12 29.97,43.88 31.24,43.88 LUXRGB2.3 31.5,43.88 31.5,44.13 31.75,44.39 33.78,44.39 v34.54,43.62 | 29.21,43.12 28.96,43.37 LUXNIR1.ADR | 27.94,40.32 28.7,40.32 29.21,40.83 C5.2 | 27.94,40.32 27.69,40.32 | 27.69,40.32 v26.16,40.32 | 27.94,40.32 v27.94,41.09 | v45.47,18.23 47.5,16.19 ISP.6
MISO  (via drill 0.61)
  Top 0.254: v34.8,33.72 34.8,34.99 33.53,36.26 29.97,36.26 29.46,36.77 26.67,36.77 25.65,35.75 25.65,34.23 23.37,31.94 23.37,31.43 IC3.11 | v46.48,24.83 50.04,21.27 ISP.1
  Bottom 0.254: v34.8,33.72 37.59,33.72 v46.48,24.83
MOSI  (via drill 0.61)
  Top 0.254: v33.27,31.69 33.27,31.94 28.96,36.26 26.92,36.26 26.16,35.5 26.16,32.7 24.13,30.67 23.37,30.67 IC3.10
  Bottom 0.254: v33.27,31.69 38.35,31.69 46.23,23.81 50.04,23.81 51.31,22.54 51.31,18.23 50.55,17.46 48.51,17.46 47.5,18.48 ISP.4
N$1
  Top 0.254: J1.3 9.14,50.74 9.14,51.25 7.87,52.52 7.87,54.8 9.14,56.07 J1.6
N$2  (via drill 0.61)
  Top 0.254: 20.07,37.28 19.56,37.28 16.51,40.32 X3.P$1 | v19.3,34.99 18.54,34.23 18.54,33.21 IC3.16 | 20.07,37.28 v21.59,37.28 | 20.07,37.28 C7.1
  Bottom 0.254: v21.59,37.28 v19.3,34.99
N$3
  Top 0.254: 16.51,36.26 14.22,38.55 13.21,38.55 C6.1 | IC3.17 17.53,35.24 16.51,36.26 | 16.51,36.26 X3.P$2
N$4  (via drill 0.61)
  Top 0.254: v46.23,37.28 T2.1 | v28.7,53.02 24.13,53.02 21.59,55.56 NKA.7
  Bottom 0.254: v46.23,37.28 46.23,36.26 46.99,35.5 48.01,35.5 53.09,40.58 53.09,46.93 43.69,56.33 39.62,56.33 38.1,54.8 38.1,54.55 37.59,54.04 30.48,54.04 29.46,53.02 v28.7,53.02
N$5  (via drill 0.61)
  Top 0.254: v16,17.72 13.97,17.72 CHARGE.C | v22.1,17.72 23.11,17.72 28.45,12.38 v28.45,12.13 | v33.02,14.92 v31.75,13.65 | v37.59,15.68 37.59,14.41 IC2.1
  Bottom 0.254: v22.1,17.72 v16,17.72 | v28.45,12.13 30.23,12.13 v31.75,13.65 | v33.02,14.92 36.83,14.92 v37.59,15.68
N$6  (via drill 0.61)
  Top 0.254: v34.54,12.38 34.54,11.37 35.31,10.61 36.07,10.61 37.08,11.62 37.59,11.62 IC2.5 | v29.46,19.75 27.43,19.75 v26.42,20.77 | v29.21,23.56 29.21,22.54 28.7,22.04 RC.2
  Bottom 0.254: v34.54,12.38 33.02,13.91 32.77,13.91 29.72,16.95 29.72,19.5 v29.46,19.75 | v29.21,23.56 v26.42,20.77
N$7
  Top 0.254: Q4.3 27.94,24.57 27.94,23.3 27.43,22.8 27.43,21.02 27.69,20.77 30.73,20.77 32.51,18.99 U$1.-
N$8  (via drill 0.61)
  Top 0.254: T1.1 46.23,35.5 v47.24,36.51 | v39.37,52.01 38.35,53.02 32.51,53.02 30.48,55.05 30.48,56.07 29.72,56.83 28.7,56.83 27.94,56.07 27.94,55.05 27.18,54.29 25.15,54.29 24.13,55.31 NKA.6
  Bottom 0.254: v47.24,36.51 48.26,36.51 52.58,40.83 52.58,46.67 47.24,52.01 v39.37,52.01
N$10
  Top 0.254: CHARGE.A 11.68,17.46 11.68,16.19 13.21,14.67 RE1.1
N$18  (via drill 0.61)
  Top 0.254: v9.91,40.07 10.41,39.56 10.41,38.55 BLNK.A | v7.87,27.62 7.87,28.64 8.38,29.15 RE2.1
  Bottom 0.254: v9.91,40.07 9.91,29.4 10.92,28.38 10.92,25.84 9.65,24.57 9.14,24.57 7.87,25.84 v7.87,27.62
N$21  (via drill 0.61)
  Top 0.254: RD+1.2 17.78,15.94 v17.53,16.19 | v24.89,25.08 24.38,25.59 23.37,25.59 IC3.4
  Bottom 0.254: v17.53,16.19 21.84,16.19 24.13,18.48 24.13,24.32 v24.89,25.08
N$22  (via drill 0.61)
  Top 0.254: v11.94,6.79 13.46,6.79 RD-1.2 | v17.78,25.08 v16.51,26.35 | v21.84,25.08 23.11,25.08 IC3.3
  Bottom 0.254: v11.94,6.79 11.94,7.81 15.75,11.62 15.75,13.14 10.41,18.48 10.41,20.26 v16.51,26.35 | v21.84,25.08 v17.78,25.08
N$23  (via drill 0.61)
  Top 0.254: v12.7,45.66 12.7,45.4 11.68,44.39 U$6.O | v15.24,48.2 13.97,48.2 U$7.I
  Bottom 0.254: v15.24,48.2 v12.7,45.66
N$24
  Top 0.254: U$7.O 17.27,44.39 17.27,45.91 19.3,47.94 U$8.I
N$25  (via drill 0.61)
  Top 0.254: v32.26,42.1 26.42,42.1 24.38,44.13 22.86,44.13 U$8.O | v36.32,39.56 v32.26,39.56 | v42.42,41.34 42.42,41.59 41.4,42.61 40.89,42.61 40.39,43.12 40.39,45.91 38.35,47.94 U$9.I
  Bottom 0.254: v32.26,39.56 v32.26,42.1 | v36.32,39.56 40.64,39.56 v42.42,41.34
N$26
  Top 0.254: U$9.O 41.66,44.39 41.66,45.91 43.69,47.94 U$10.I
N$28  (via drill 0.61)
  Top 0.254: v47.24,42.36 47.24,44.13 U$10.O | v50.8,46.67 49.53,47.94 U$11.I
  Bottom 0.254: v47.24,42.36 48.51,42.36 50.29,40.58 51.31,40.58 52.07,41.34 52.07,45.4 v50.8,46.67
RESET  (via drill 0.61)
  Top 0.254: BTN1.B 52.83,40.83 52.83,34.23 BTN1.B' 52.58,33.97 52.58,19.24 49.78,16.45 | v18.54,36.01 19.56,36.01 20.57,34.99 20.57,33.21 IC3.13 | v19.81,40.32 21.08,40.32 21.84,41.09 25.65,41.09 25.91,41.34 26.42,41.34 27.69,40.07 30.48,40.07 35.81,34.73 35.81,30.93 v35.56,30.67 | v41.4,24.83 41.4,18.73 42.93,17.21 49.02,17.21 49.78,16.45 | 49.78,16.45 50.04,16.19 ISP.5 49.78,16.45
  Bottom 0.254: v18.54,36.01 18.54,39.05 v19.81,40.32 | v41.4,24.83 v35.56,30.67
RXD  (via drill 0.61)
  Top 0.254: v15.49,30.42 14.73,31.18 14.73,31.94 14.99,32.2 14.99,32.96 IC3.20 | v31.5,28.89 v28.7,31.69 | v25.91,13.65 26.42,13.65 27.18,12.89 27.18,8.57 JP2.3
  Bottom 0.254: v15.49,30.42 16.51,29.4 17.53,29.4 18.8,30.67 27.69,30.67 v28.7,31.69 | v31.5,28.89 31.5,23.81 27.94,20.26 27.94,18.99 28.7,18.23 28.7,16.45 v25.91,13.65
SCK  (via drill 0.61)
  Top 0.254: v21.84,28.13 21.84,29.15 22.35,29.65 23.11,29.65 IC3.9 | v23.11,22.29 24.64,22.29 v25.4,21.53 | v27.69,17.97 29.46,17.97 v30.73,19.24
  Bottom 0.254: v21.84,28.13 21.84,26.35 23.11,25.08 v23.11,22.29 | v25.4,21.53 25.4,20.26 v27.69,17.97 | v30.73,19.24 41.4,19.24 42.16,20 48.77,20 50.04,18.73 ISP.3
SCL  (via drill 0.61)
  Top 0.254: IRL.1 30.48,37.53 30.23,37.28 23.62,37.28 RIR3.1 23.37,37.02 v22.1,35.75 | v25.4,45.66 26.42,46.67 27.18,46.67 LUXNIR.CLK | v17.78,31.43 16.76,32.45 16.76,32.96 IC3.18 | 34.54,46.16 38.35,46.16 39.88,44.64 39.88,39.82 EEPRM.6 40.13,39.56 40.13,38.55 42.42,36.26 v42.42,18.99 | 34.54,46.16 LUXRGB1.2 | 34.54,46.16 v34.54,46.67
  Bottom 0.254: LUXRGB2.2 30.73,43.37 29.46,42.1 27.69,42.1 27.18,42.61 LUXNIR1.CLK 26.92,42.61 25.91,42.61 24.64,43.88 24.64,44.39 | 24.64,44.39 25.4,45.15 v25.4,45.66 29.72,45.66 30.73,46.67 v34.54,46.67 | v17.78,31.43 17.78,32.2 21.34,35.75 | 21.34,35.75 22.86,37.28 22.86,41.59 22.61,41.85 22.61,42.36 24.64,44.39 | 21.34,35.75 v22.1,35.75 | v42.42,18.99 34.8,11.37 34.8,8.32 JP2.6
SDA  (via drill 0.61)
  Top 0.254: 31.24,44.64 31.24,45.66 LUXRGB1.6 | 31.24,44.64 30.48,43.88 28.96,43.88 28.7,44.13 | 28.7,44.13 27.43,45.4 LUXNIR.DATA | 28.7,44.13 v25.65,44.13 24.64,45.15 v24.13,45.15 | v15.75,31.69 15.75,32.96 IC3.19 | RIR4.1 34.54,29.4 34.54,31.69 33.02,33.21 33.02,34.99 IRA.1 | v41.15,41.59 41.15,39.82 EEPRM.5 | v42.42,6.79 v38.61,6.79 | 31.24,44.64 33.53,42.36 v33.53,41.85
  Bottom 0.254: v25.65,44.13 26.92,44.13 LUXNIR1.DATA | v15.75,31.69 13.72,33.72 13.46,33.72 12.7,34.48 12.7,37.02 19.3,43.62 22.61,43.62 v24.13,45.15 | 33.27,37.78 33.27,35.24 33.02,34.99 IRA.1 | 33.27,37.78 33.27,41.59 | 33.27,41.59 33.27,41.85 | 33.27,41.85 33.27,42.86 LUXRGB2.6 | 33.27,41.59 v41.15,41.59 | v38.61,6.79 33.78,6.79 32.26,8.32 JP2.5 | v42.42,6.79 51.82,16.19 51.82,29.4 43.43,37.78 33.27,37.78 | 33.27,41.85 v33.53,41.85
TXD  (via drill 0.61)
  Top 0.254: v14.48,29.65 14.22,29.91 14.22,32.96 IC3.21 | v27.94,48.2 v24.13,48.2 | v47.5,39.05 47.5,37.53 48.26,36.77 48.26,36.26 47.24,35.24 47.24,34.23 43.69,30.67 v43.69,18.23
  Bottom 0.254: v14.48,29.65 14.48,31.94 12.19,34.23 12.19,37.28 23.11,48.2 v24.13,48.2 | v27.94,48.2 38.35,48.2 v47.5,39.05 | v43.69,18.23 43.69,10.1 39.37,5.78 32,5.78 29.72,8.06 JP2.4
VBAT  (via drill 0.61)
  Top 0.254: BAT1.P$2 46.74,8.06 41.91,12.89 36.58,12.89 35.81,13.65 35.81,14.16 IC2.3 35.56,14.41 v35.56,15.94 | 10.67,50.74 11.68,50.74 J1.2 | 10.67,50.74 9.4,52.01 9.14,52.01 8.38,52.77 8.38,54.04 9.65,55.31 10.92,55.31 11.68,56.07 J1.5 | 10.67,50.74 10.67,47.94 v10.16,47.44 | v6.86,23.81 6.86,22.8 7.11,22.54 CN1.1 | v32,15.94 27.18,15.94 v26.92,16.19 | v16.26,14.67 14.73,13.14 v14.73,12.89
  Bottom 0.254: v10.16,47.44 10.16,46.93 8.38,45.15 8.38,32.7 5.84,30.16 5.84,29.65 6.86,28.64 v6.86,23.81 6.86,21.27 14.73,13.4 v14.73,12.89 | v32,15.94 v35.56,15.94 | v26.92,16.19 22.61,16.19 21.08,14.67 v16.26,14.67
VBUS  (via drill 0.61)
  Top 0.254: 10.41,12.64 8.89,12.64 8.64,12.38 X2.VBUS | 10.41,12.64 13.21,12.64 RE1.2 | IC2.4 35.56,11.88 35.56,13.14 34.54,14.16 v34.54,16.95 34.54,19.24 35.56,20.26 36.07,20.26 C1.1 36.07,20.51 36.83,21.27 | v24.89,28.64 24.64,28.38 23.37,28.38 IC3.7 | v37.59,23.81 37.59,22.04 36.83,21.27 | 36.83,21.27 v37.59,21.27 | 10.41,12.64 10.41,16.19 10.16,16.45 7.11,16.45 4.83,14.16 4.83,13.91 v3.56,12.64 | v19.56,6.29 20.07,6.29 20.83,5.53 48.77,5.53 49.28,6.03 49.28,9.84 43.43,15.68 38.86,15.68 v37.59,16.95
  Bottom 0.254: v24.89,28.64 27.94,28.64 29.72,30.42 32,30.42 37.59,24.83 v37.59,23.81 | v37.59,21.27 47.5,21.27 ISP.2 | v3.56,12.64 6.1,10.1 6.86,10.1 9.91,7.05 9.91,6.79 11.43,5.27 14.73,5.27 15.75,6.29 v19.56,6.29 | v34.54,16.95 v37.59,16.95
VCC  (via drill 0.61)
  Top 0.254: v16.51,23.05 14.22,23.05 13.72,22.54 13.72,21.78 IC3.34 | 20.07,22.8 20.07,21.78 IC3.42 | 20.07,22.8 20.83,22.8 | 20.83,22.8 21.08,22.8 21.34,22.54 21.34,21.78 IC3.44 21.34,21.53 21.34,18.23 21.08,17.97 21.08,15.94 21.84,15.18 C3.1 21.84,14.92 22.35,14.92 23.11,14.16 23.11,9.59 22.1,8.57 JP2.1 | 20.07,22.8 v20.07,23.05 | 21.84,26.61 20.83,25.59 20.83,22.8 | 21.84,26.61 22.61,27.37 IC3.6 24.89,27.37 v27.18,29.65 | 21.84,26.61 19.81,28.64 19.81,29.4 20.07,29.65 20.07,32.96 IC3.14 | v19.05,9.34 19.05,9.08 18.03,8.06 RU1.2 | v29.97,13.14 31.24,11.88 32.51,11.88 U$1.+ | 49.53,52.77 50.55,51.75 THM1.2 | 49.53,52.77 47.24,55.05 45.21,55.05 C4.1 | T1.2 44.2,33.97 45.21,34.99 45.21,37.28 44.2,38.29 T2.2 44.2,38.55 43.18,39.56 43.18,40.83 43.69,41.34 43.69,42.61 | 43.69,42.61 43.69,44.13 U$10.D 43.94,44.39 45.21,45.66 46.23,45.66 | 46.23,45.66 48.01,45.66 49.28,44.39 U$11.D | 49.53,52.77 46.23,49.47 46.23,45.66 | v10.92,32.7 10.41,32.2 10.41,31.18 10.92,30.67 11.68,30.67 IC3.24 | 12.45,42.61 13.97,44.13 U$7.D | U$6.D 8.38,44.13 9.4,44.13 11.18,42.36 v12.19,42.36 12.45,42.61 | 18.29,43.12 17.78,42.61 12.45,42.61 | 18.29,43.12 19.3,44.13 U$8.D | v30.23,44.9 29.46,44.9 28.96,45.4 | 28.96,45.4 28.96,45.91 LUXNIR.ADR | 28.96,45.4 30.99,47.44 30.99,48.71 C14.1 | 28.96,45.4 LUXNIR.VDD | 34.54,45.66 36.83,45.66 37.59,44.9 | 34.54,45.66 33.27,45.66 LUXRGB1.1 | 37.59,44.9 38.1,44.39 U$9.D | 37.59,44.9 37.59,39.82 EEPRM.8 37.34,39.56 37.34,36.26 36.58,35.5 36.58,29.4 RIR4.2 36.32,29.15 36.32,28.38 34.8,26.86 | 34.54,45.66 v34.54,44.9 | v29.72,39.05 23.62,39.05 RIR3.2 23.37,39.05 v21.84,39.05
  Top 0.254: 34.8,26.86 33.27,25.34 IC4.2 | 34.8,26.86 30.48,31.18 30.48,32.45 IRP.1 30.23,32.45 29.21,33.47 v29.21,34.73 | v19.56,41.85 18.29,43.12 | v42.67,42.61 43.69,42.61
  Bottom 0.254: v20.07,23.05 v16.51,23.05 | v19.05,9.34 21.08,9.34 21.84,8.57 JP2.1 22.1,8.57 22.86,8.57 27.43,13.14 v29.97,13.14 | v10.92,32.7 10.92,41.09 v12.19,42.36 | LUXNIR1.VDD 28.96,44.13 29.46,44.13 v30.23,44.9 v34.54,44.9 36.83,42.61 v42.67,42.61 | LUXRGB2.1 31.24,42.86 31.24,40.83 C5.1 30.99,40.83 30.99,40.32 v29.72,39.05 29.72,38.55 29.21,38.04 v29.21,34.73 | v19.56,41.85 21.84,39.56 v21.84,39.05 | v27.18,29.65 27.94,29.65 30.23,31.94 30.23,32.45 IRP.1
VDD  (via drill 0.61)
  Top 0.254: J1.1 14.22,50.74 14.22,52.01 14.99,52.77 14.99,55.31 14.22,56.07 J1.4 13.97,56.07 v12.95,56.07 | v33.53,26.86 33.27,27.11 32.26,27.11 IC4.3 | v34.54,23.3 35.81,23.3 36.07,23.56 C2.1 | v16.51,8.57 17.02,9.08 17.53,9.08 v19.05,10.61
  Bottom 0.254: 33.53,25.08 33.53,24.32 v34.54,23.3 | 33.53,25.08 v33.53,26.86 | v12.95,56.07 7.87,56.07 3.05,51.25 2.03,51.25 1.27,50.48 1.27,20 10.41,10.86 10.41,7.05 11.68,5.78 13.72,5.78 v16.51,8.57 | v19.05,10.61 24.13,10.61 29.21,15.68 29.21,18.73 28.45,19.5 28.45,20 33.53,25.08

### Text on the board
tPlace: off | on | ***OPEN-LUX*** | REV-E | http://publiclab.org | /wiki/open-lux | LUX | RGB | + | - | JST | USB
bPlace: NOKIA 5110 | publiclab.org/wiki/open-lux | GND | LED | VCC | D6 | D7 | D8 | GND | D9 | LUX | RGB | VBUS | MOSI | MISO | SCK | GND | RESET